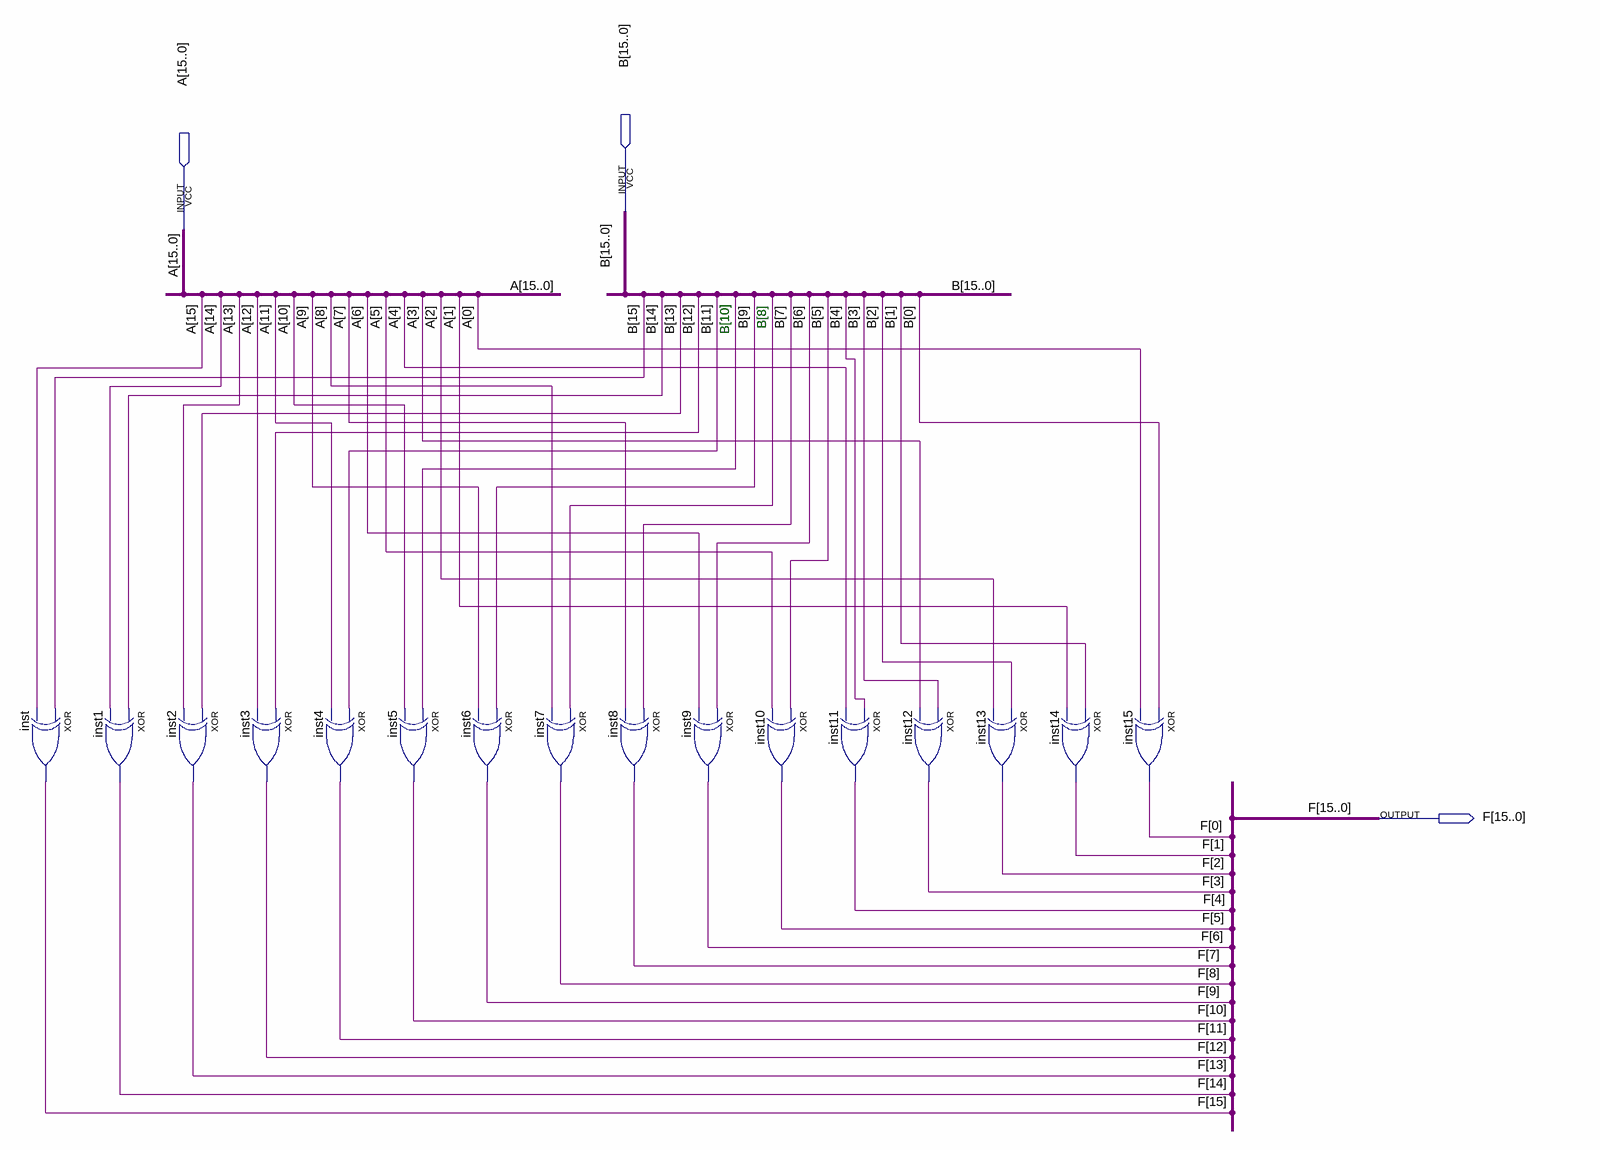
[diagram p0: schematic sheet]
// Quartus schematic XORR.bdf as structural Verilog: 16 symbols, 3 pins
module XORR (
  input  [15:0] B,
  input  [15:0] A,
  output [15:0] F
);

  xor inst (F[15], B[15], A[15]);
  xor inst1 (F[14], B[14], A[14]);
  xor inst2 (F[13], B[13], A[13]);
  xor inst3 (F[12], B[12], A[12]);
  xor inst4 (F[11], B[11], A[11]);
  xor inst5 (F[10], B[10], A[10]);
  xor inst6 (F[9], B[9], A[9]);
  xor inst7 (F[8], B[8], A[8]);
  xor inst8 (F[7], B[7], A[7]);
  xor inst9 (F[6], B[6], A[6]);
  xor inst10 (F[5], B[5], A[5]);
  xor inst11 (F[4], B[4], A[4]);
  xor inst12 (F[3], B[3], A[3]);
  xor inst13 (F[2], B[2], A[2]);
  xor inst14 (F[1], B[1], A[1]);
  xor inst15 (F[0], B[0], A[0]);

  // Notes on the sheet:
  //   B[10]
  //   B[8]
endmodule
